# EAGLE design klaw2bcd (EAGLE 6.3)
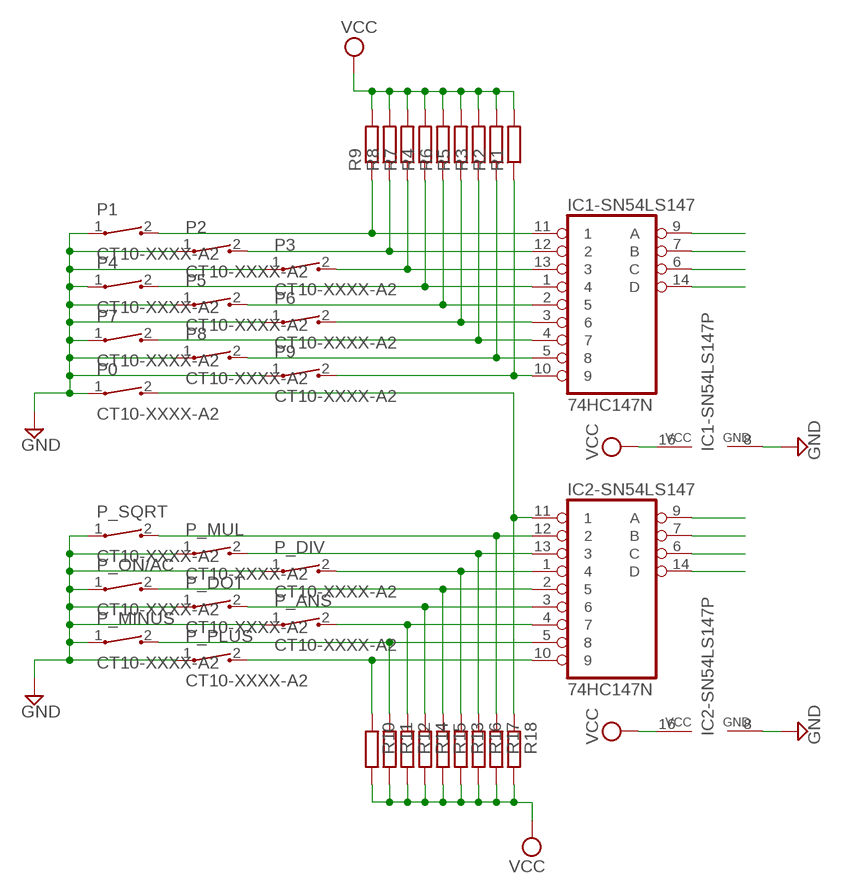
[diagram p0: schematic, sheet 1]

## Parts
IC1-SN54LS147  74HC147N  [DIL16]
IC2-SN54LS147  74HC147N  [DIL16]
P0  CT10-XXXX-A2  [CT10-XXXX-A2]
P1  CT10-XXXX-A2  [CT10-XXXX-A2]
P2  CT10-XXXX-A2  [CT10-XXXX-A2]
P3  CT10-XXXX-A2  [CT10-XXXX-A2]
P4  CT10-XXXX-A2  [CT10-XXXX-A2]
P5  CT10-XXXX-A2  [CT10-XXXX-A2]
P6  CT10-XXXX-A2  [CT10-XXXX-A2]
P7  CT10-XXXX-A2  [CT10-XXXX-A2]
P8  CT10-XXXX-A2  [CT10-XXXX-A2]
P9  CT10-XXXX-A2  [CT10-XXXX-A2]
P_ANS  CT10-XXXX-A2  [CT10-XXXX-A2]
P_DIV  CT10-XXXX-A2  [CT10-XXXX-A2]
P_DOT  CT10-XXXX-A2  [CT10-XXXX-A2]
P_MINUS  CT10-XXXX-A2  [CT10-XXXX-A2]
P_MUL  CT10-XXXX-A2  [CT10-XXXX-A2]
P_ON/AC  CT10-XXXX-A2  [CT10-XXXX-A2]
P_PLUS  CT10-XXXX-A2  [CT10-XXXX-A2]
P_SQRT  CT10-XXXX-A2  [CT10-XXXX-A2]
R1  R-EU_0204/5  [0204/5]
R2  R-EU_0204/5  [0204/5]
R3  R-EU_0204/5  [0204/5]
R4  R-EU_0204/5  [0204/5]
R5  R-EU_0204/5  [0204/5]
R6  R-EU_0204/5  [0204/5]
R7  R-EU_0204/5  [0204/5]
R8  R-EU_0204/5  [0204/5]
R9  R-EU_0204/5  [0204/5]
R10  R-EU_0204/5  [0204/5]
R11  R-EU_0204/5  [0204/5]
R12  R-EU_0204/5  [0204/5]
R13  R-EU_0204/5  [0204/5]
R14  R-EU_0204/5  [0204/5]
R15  R-EU_0204/5  [0204/5]
R16  R-EU_0204/5  [0204/5]
R17  R-EU_0204/5  [0204/5]
R18  R-EU_0204/5  [0204/5]

## Nets
GND: IC1-SN54LS147.8(GND) IC2-SN54LS147.8(GND) P0.1 P1.1 P2.1 P3.1 P4.1 P5.1 P6.1 P7.1 P8.1 P9.1 P_ANS.1 P_DIV.1 P_DOT.1 P_MINUS.1 P_MUL.1 P_ON/AC.1 P_PLUS.1 P_SQRT.1
N$1: IC1-SN54LS147.11 P1.2 R9.1
N$2: IC1-SN54LS147.12 P2.2 R8.1
N$3: IC1-SN54LS147.13 P3.2 R7.1
N$4: IC1-SN54LS147.1 P4.2 R4.1
N$5: IC1-SN54LS147.2 P5.2 R6.1
N$6: IC1-SN54LS147.3 P6.2 R5.1
N$7: IC1-SN54LS147.4 P7.2 R3.1
N$8: IC1-SN54LS147.5 P8.2 R2.1
N$9: IC1-SN54LS147.10 P9.2 R1.1
N$11: IC2-SN54LS147.11 P0.2 R18.1
N$12: IC2-SN54LS147.12 P_SQRT.2 R17.1
N$13: IC2-SN54LS147.13 P_MUL.2 R16.1
N$14: IC2-SN54LS147.1 P_DIV.2 R13.1
N$15: IC2-SN54LS147.2 P_ON/AC.2 R15.1
N$16: IC2-SN54LS147.3 P_DOT.2 R14.1
N$17: IC2-SN54LS147.4 P_ANS.2 R12.1
N$18: IC2-SN54LS147.5 P_MINUS.2 R11.1
N$19: IC2-SN54LS147.10 P_PLUS.2 R10.1
N$21: IC1-SN54LS147.9(A)
N$22: IC1-SN54LS147.7(B)
N$23: IC1-SN54LS147.6(C)
N$24: IC1-SN54LS147.14(D)
N$25: IC2-SN54LS147.9(A)
N$26: IC2-SN54LS147.7(B)
N$27: IC2-SN54LS147.6(C)
N$28: IC2-SN54LS147.14(D)
VCC: IC1-SN54LS147.16(VCC) IC2-SN54LS147.16(VCC) R1.2 R2.2 R3.2 R4.2 R5.2 R6.2 R7.2 R8.2 R9.2 R10.2 R11.2 R12.2 R13.2 R14.2 R15.2 R16.2 R17.2 R18.2

## Library data of the parts
IC1-SN54LS147 IC2-SN54LS147 = 74xx-eu:74*147: 10-line to 4-line and 8-line to 3-line PRIORITY DECODER
P0 P1-P9 P_ANS P_DIV P_DOT P_MINUS P_MUL P_ON/AC P_PLUS P_SQRT = switch-coto:CT10-XXXX-: CT10 Series Molded Switch Source: www.cotorelay.com .. Coto_Technology__CT10-1530-G1.pdf
R1-R18 = rcl:R-EU_: RESISTOR, European symbol

## Board
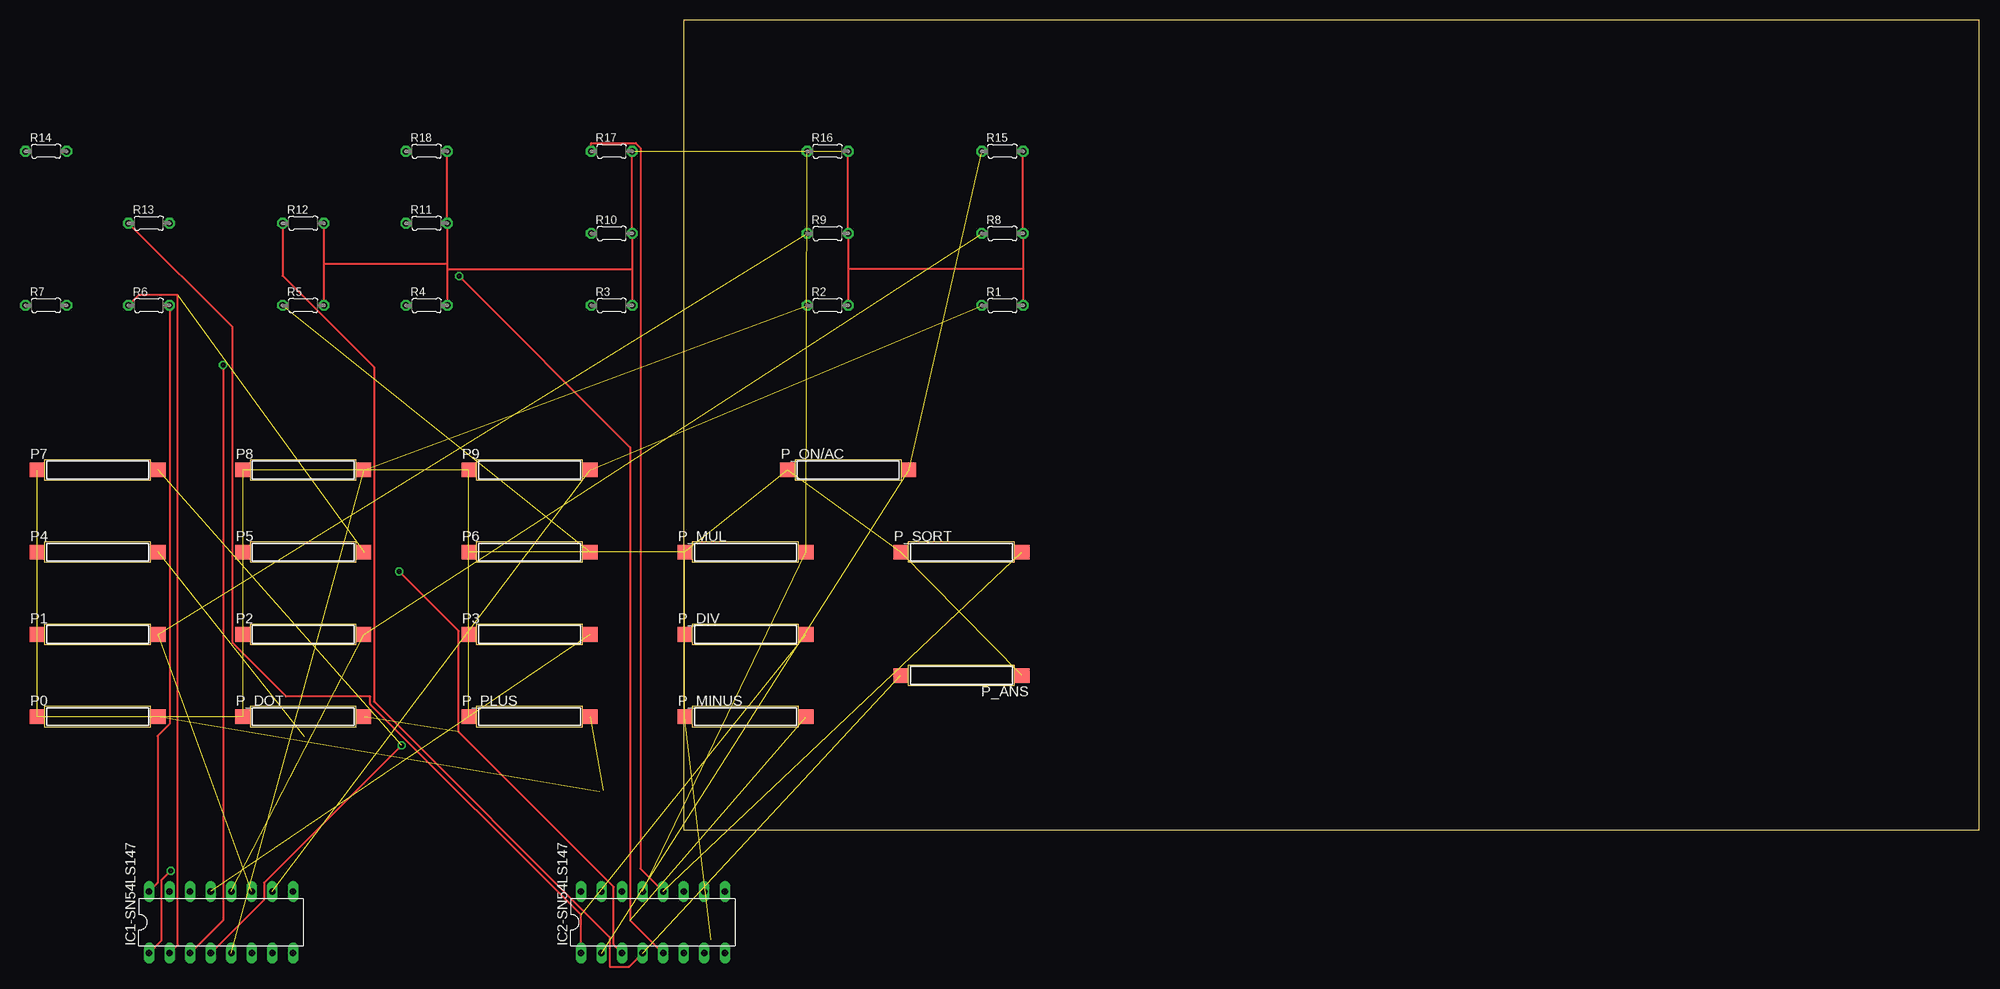
[diagram p1: board, top side]
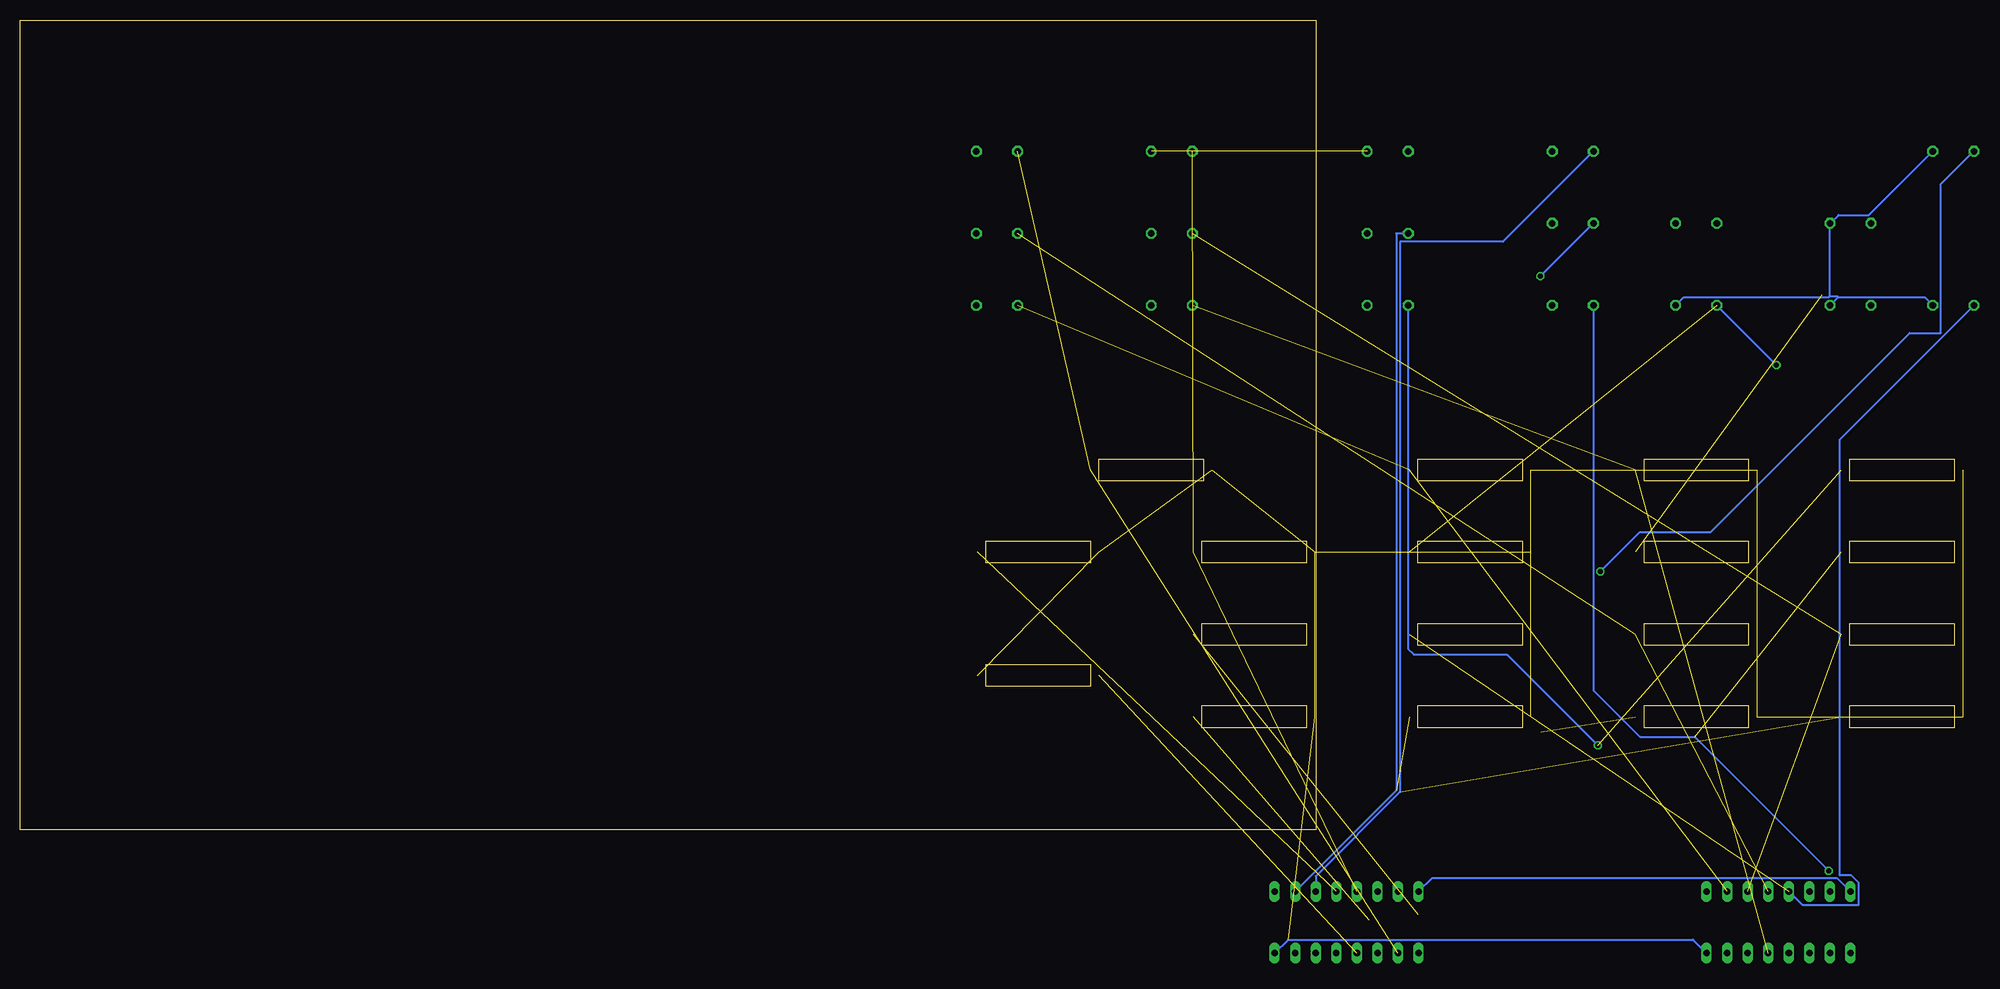
[diagram p2: board, bottom side, seen from below]

Size 238.89 x 100 mm. Coordinates in mm from the lower left corner, seen from the top.
Outline: 78.89,0 238.89,0 238.89,100 78.89,100 78.89,0
Copper layers (1*16): Top 0.035mm / dielectric 1.5mm / Bottom 0.035mm
Design rules "default": minimum track width 10mil, minimum drill 24mil, track to track 8mil, track to pad 8mil, pad to pad 8mil, via to via 8mil, smd to smd 8mil, copper to edge 40mil, drill to drill 8mil, minimum pad ring 10mil, minimum via ring 8mil, stop-mask expansion 4mil, vias tented up to drill 0mil, thermal gap 10mil

### Footprints (pad centres in the part's own frame; a part is rotated, then mirrored left to right if it is on the bottom)
DIL16 = drill 0.813 long: 1 -8.89,-3.81; 2 -6.35,-3.81; 3 -3.81,-3.81; 4 -1.27,-3.81; 5 1.27,-3.81; 6 3.81,-3.81; 7 6.35,-3.81; 8 8.89,-3.81; 9 8.89,3.81; 10 6.35,3.81; 11 3.81,3.81; 12 1.27,3.81; 13 -1.27,3.81; 14 -3.81,3.81; 15 -6.35,3.81; 16 -8.89,3.81
CT10-XXXX-A2 = smd 1.8 x 1.8: 1 -7.5,0; 2 7.5,0
0204/5 = drill 0.813 octagon: 1 -2.54,0; 2 2.54,0

### Placement (x,y rotation side)
IC1-SN54LS147  21.74,-11.43 0 top  (outside the outline)
IC2-SN54LS147  75.08,-11.43 0 top  (outside the outline)
P0  6.5,13.97 0 top
P1  6.5,24.13 0 top
P2  31.9,24.13 0 top
P3  59.84,24.13 0 top
P4  6.5,34.29 0 top
P5  31.9,34.29 0 top
P6  59.84,34.29 0 top
P7  6.5,44.45 0 top
P8  31.9,44.45 0 top
P9  59.84,44.45 0 top
P_ANS  113.18,19.05 180 top
P_DIV  86.51,24.13 0 top
P_DOT  31.9,13.97 0 top
P_MINUS  86.51,13.97 0 top
P_MUL  86.51,34.29 0 top
P_ON/AC  99.21,44.45 0 top
P_PLUS  59.84,13.97 0 top
P_SQRT  113.18,34.29 0 top
R1  118.26,64.77 0 top
R2  96.67,64.77 0 top
R3  70,64.77 0 top
R4  47.14,64.77 0 top
R5  31.9,64.77 0 top
R6  12.85,64.77 0 top
R7  0.15,64.77 0 top
R8  118.26,73.66 0 top
R9  96.67,73.66 0 top
R10  70,73.66 0 top
R11  47.14,74.93 0 top
R12  31.9,74.93 0 top
R13  12.85,74.93 0 top
R14  0.15,83.82 0 top
R15  118.26,83.82 0 top
R16  96.67,83.82 0 top
R17  70,83.82 0 top
R18  47.14,83.82 0 top

### Tracks (layer width: path | path; a pad name or v marks a point on that pad's centre or on a via)
GND  (18 unrouted)
  Bottom 0.254: IC1-SN54LS147.8 32.31,-13.56 82.29,-13.56 IC2-SN54LS147.8
N$1  (2 unrouted)
N$2  (2 unrouted)
N$3  (1 unrouted)
  Bottom 0.254: R7.1 14.17,48.21 14.17,-5.64 12.75,-5.64 11.83,-6.55 11.83,-9.3 18.79,-9.3 IC1-SN54LS147.13
N$4  (via drill 0.61)  (1 unrouted)
  Top 0.254: IC1-SN54LS147.1 14.37,-13.72 14.37,-6.25 v15.54,-5.08
  Bottom 0.254: v15.54,-5.08 32.1,11.48 38.86,11.48 44.6,17.22 R4.1
N$5  (1 unrouted)
  Top 0.254: R6.1 11.58,66.04 16.41,66.04 16.41,-14.22 IC1-SN54LS147.2
N$6  (via drill 0.61)  (1 unrouted)
  Top 0.254: IC1-SN54LS147.3 21.99,-11.18 v21.99,57.4
  Bottom 0.254: R5.1 v21.99,57.4
N$7  (via drill 0.61)  (1 unrouted)
  Top 0.254: IC1-SN54LS147.4 27.07,-8.64 27.07,-6.55 v44.04,10.41
  Bottom 0.254: v44.04,10.41 55.27,21.64 66.8,21.64 67.51,22.35 67.51,64.77 R3.1
N$8  (2 unrouted)
N$9  (2 unrouted)
N$11  (1 unrouted)
  Bottom 0.254: IC2-SN54LS147.11 78.89,-5.74 68.48,4.67 68.48,72.64 55.78,72.64 R18.1
N$12  (1 unrouted)
  Top 0.254: IC2-SN54LS147.12 73.56,-4.83 73.56,84.23 72.95,84.84 67.46,84.84 R17.1
N$13  (2 unrouted)
N$14  (1 unrouted)
  Top 0.254: R13.1 23.16,62.08 23.16,23.06 29.77,16.46 40.18,16.46 40.18,15.49 66.19,-10.52 IC2-SN54LS147.1
N$15  (2 unrouted)
N$16  (via drill 0.61)  (1 unrouted)
  Top 0.254: v43.74,31.9 51.1,24.54 51.1,12.09 70.25,-7.06 70.25,-14.22 IC2-SN54LS147.3
  Bottom 0.254: R14.1 1.67,79.76 1.67,61.37 5.53,61.37 30.12,36.78 38.86,36.78 v43.74,31.9
N$17  (1 unrouted)
  Top 0.254: IC2-SN54LS147.4 72.13,-16.92 69.75,-16.92 69.75,-13.26 40.64,15.85 40.64,57.15 29.36,68.43 R12.1
N$18  (via drill 0.61)  (1 unrouted)
  Top 0.254: IC2-SN54LS147.5 72.29,-11.18 72.29,47.24 v51.15,68.38
  Bottom 0.254: R11.1 v51.15,68.38
N$19  (1 unrouted)
  Bottom 0.254: IC2-SN54LS147.10 68.93,4.88 68.93,73.66 R10.1
VCC  (1 unrouted)
  Top 0.254: 72.54,69.24 R10.2 R17.2 | 72.54,69.24 R3.2 | R12.2 34.44,69.85 | 34.44,69.85 R5.2 | 49.68,69.85 R11.2 R18.2 | 49.68,69.85 49.68,69.24 | 49.68,69.24 R4.2 | 49.68,69.85 34.44,69.85 | 49.68,69.24 72.54,69.24 | IC1-SN54LS147.16 13.92,-6.55 13.92,11.58 15.39,13.06 R6.2 | 99.21,69.24 R9.2 R16.2 | 99.21,69.24 R2.2 | 120.8,69.24 R8.2 R15.2 | 120.8,69.24 R1.2 | 120.8,69.24 99.21,69.24
  Bottom 0.254: IC1-SN54LS147.16 14.53,-5.94 64.51,-5.94 IC2-SN54LS147.16 | R7.2 3.71,65.79 14.37,65.79 | R6.2 14.37,65.79 | 15.39,65.89 R13.2 15.29,74.98 14.32,75.95 10.56,75.95 R14.2 | 15.39,65.89 14.42,65.89 14.37,65.79 | R5.2 33.42,65.79 15.54,65.79 15.49,65.84 15.39,65.89